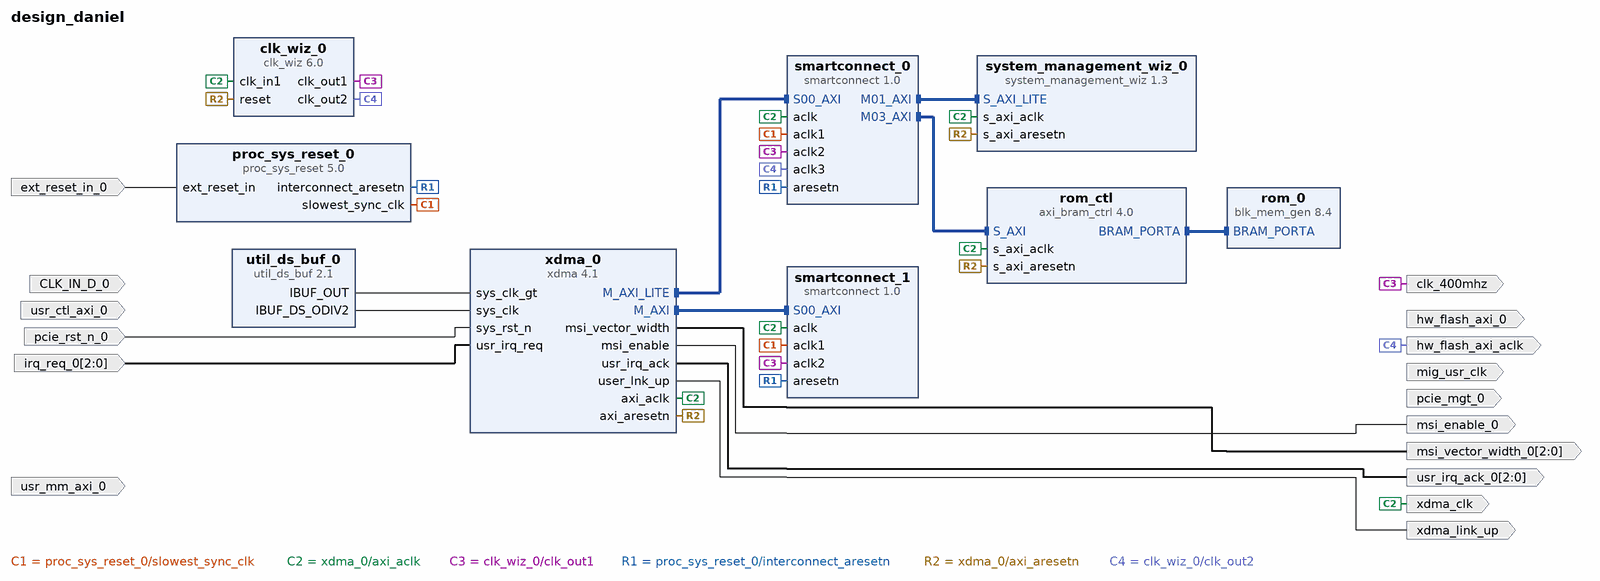
[diagram p0: block diagram of the top level]
# Vivado block design design_daniel, xcvu9p-flgb2104-2-i, Vivado 2018.2_AR71275_op
create_bd_design design_daniel

create_bd_port -dir O xdma_clk
create_bd_port -dir O mig_usr_clk
create_bd_port -dir O clk_400mhz
create_bd_port -dir I usr_mm_axi_0
create_bd_port -dir I usr_ctl_axi_0
create_bd_port -dir O hw_flash_axi_0
create_bd_port -dir I ext_reset_in_0
create_bd_port -dir O hw_flash_axi_aclk
create_bd_port -dir I -type clk CLK_IN_D_0
create_bd_port -dir I pcie_rst_n_0
create_bd_port -dir I -from 2 -to 0 irq_req_0
create_bd_port -dir O -from 2 -to 0 msi_vector_width_0
create_bd_port -dir O msi_enable_0
create_bd_port -dir O -from 2 -to 0 usr_irq_ack_0
create_bd_port -dir O xdma_link_up
create_bd_port -dir O pcie_mgt_0

create_bd_cell -type ip -vlnv xilinx.com:ip:smartconnect:1.0 smartconnect_0
set_property -dict {CONFIG.NUM_MI 5 CONFIG.NUM_CLKS 4} [get_bd_cells smartconnect_0]
create_bd_cell -type ip -vlnv xilinx.com:ip:smartconnect:1.0 smartconnect_1
set_property -dict {CONFIG.NUM_CLKS 3} [get_bd_cells smartconnect_1]
create_bd_cell -type ip -vlnv xilinx.com:ip:proc_sys_reset:5.0 proc_sys_reset_0
create_bd_cell -type ip -vlnv xilinx.com:ip:axi_bram_ctrl:4.0 rom_ctl
set_property -dict {CONFIG.SINGLE_PORT_BRAM 1} [get_bd_cells rom_ctl]
create_bd_cell -type ip -vlnv xilinx.com:ip:system_management_wiz:1.3 system_management_wiz_0
create_bd_cell -type ip -vlnv xilinx.com:ip:xdma:4.1 xdma_0
set_property -dict [list \
  CONFIG.functional_mode DMA \
  CONFIG.mode_selection Advanced \
  CONFIG.pcie_blk_locn X0Y1 \
  CONFIG.pl_link_cap_max_link_width X1 \
  CONFIG.axi_data_width 64_bit \
  CONFIG.en_axi_slave_if false \
  CONFIG.pipe_sim false \
  CONFIG.en_ext_ch_gt_drp false \
  CONFIG.en_pcie_drp false \
  CONFIG.sys_reset_polarity ACTIVE_LOW \
  CONFIG.pf0_device_id 9011 \
  CONFIG.pf0_Use_Class_Code_Lookup_Assistant false \
  CONFIG.axilite_master_en true \
  CONFIG.axist_bypass_en false \
  CONFIG.pf0_msi_enabled true \
  CONFIG.en_transceiver_status_ports false \
  CONFIG.xdma_axilite_slave false \
  CONFIG.en_gt_selection false \
  CONFIG.xdma_axi_intf_mm AXI_Memory_Mapped \
  CONFIG.xdma_pcie_64bit_en false \
  CONFIG.xdma_sts_ports false \
  CONFIG.pf0_msix_enabled false \
  CONFIG.axil_master_64bit_en false \
  CONFIG.parity_settings None \
  CONFIG.dma_reset_source_sel User_Reset \
  CONFIG.PF0_DEVICE_ID_mqdma 9011 \
  CONFIG.PF2_DEVICE_ID_mqdma 9011 \
  CONFIG.PF3_DEVICE_ID_mqdma 9011 \
  CONFIG.enable_auto_rxeq False \
] [get_bd_cells xdma_0]
create_bd_cell -type ip -vlnv xilinx.com:ip:util_ds_buf:2.1 util_ds_buf_0
set_property -dict {CONFIG.C_BUF_TYPE IBUFDSGTE} [get_bd_cells util_ds_buf_0]
create_bd_cell -type ip -vlnv xilinx.com:ip:clk_wiz:6.0 clk_wiz_0
set_property -dict [list \
  CONFIG.USE_INCLK_SWITCHOVER false \
  CONFIG.SECONDARY_SOURCE Single_ended_clock_capable_pin \
  CONFIG.CLKIN2_JITTER_PS 149.99 \
  CONFIG.CLKOUT2_USED true \
  CONFIG.NUM_OUT_CLKS 2 \
  CONFIG.MMCM_DIVCLK_DIVIDE 1 \
  CONFIG.MMCM_CLKIN2_PERIOD 10.000 \
  CONFIG.MMCM_CLKOUT1_DIVIDE 12 \
  CONFIG.CLKOUT2_JITTER 115.831 \
  CONFIG.CLKOUT2_PHASE_ERROR 87.180 \
] [get_bd_cells clk_wiz_0]
create_bd_cell -type ip -vlnv xilinx.com:ip:blk_mem_gen:8.4 rom_0

# ---- connections ----

connect_bd_intf_net [get_bd_intf_pins smartconnect_0/M01_AXI] [get_bd_intf_pins system_management_wiz_0/S_AXI_LITE]
connect_bd_intf_net [get_bd_intf_pins smartconnect_0/M03_AXI] [get_bd_intf_pins rom_ctl/S_AXI]
connect_bd_intf_net -intf_net axi_bram_ctrl_0_BRAM_PORTA [get_bd_intf_pins rom_ctl/BRAM_PORTA] [get_bd_intf_pins rom_0/BRAM_PORTA]
connect_bd_intf_net [get_bd_intf_pins xdma_0/M_AXI] [get_bd_intf_pins smartconnect_1/S00_AXI]
connect_bd_intf_net [get_bd_intf_pins smartconnect_0/S00_AXI] [get_bd_intf_pins xdma_0/M_AXI_LITE]
connect_bd_net [get_bd_pins proc_sys_reset_0/slowest_sync_clk] [get_bd_pins smartconnect_1/aclk1] [get_bd_pins smartconnect_0/aclk1]
connect_bd_net [get_bd_pins xdma_0/axi_aclk] \
  [get_bd_ports xdma_clk] [get_bd_pins clk_wiz_0/clk_in1] [get_bd_pins system_management_wiz_0/s_axi_aclk] \
  [get_bd_pins rom_ctl/s_axi_aclk] [get_bd_pins smartconnect_1/aclk] [get_bd_pins smartconnect_0/aclk]
connect_bd_net [get_bd_pins clk_wiz_0/clk_out1] [get_bd_pins smartconnect_1/aclk2] [get_bd_pins smartconnect_0/aclk2] [get_bd_ports clk_400mhz]
connect_bd_net [get_bd_pins proc_sys_reset_0/interconnect_aresetn] [get_bd_pins smartconnect_1/aresetn] [get_bd_pins smartconnect_0/aresetn]
connect_bd_net -net ext_reset_in_0_1 [get_bd_ports ext_reset_in_0] [get_bd_pins proc_sys_reset_0/ext_reset_in]
connect_bd_net [get_bd_pins xdma_0/axi_aresetn] \
  [get_bd_pins clk_wiz_0/reset] [get_bd_pins system_management_wiz_0/s_axi_aresetn] [get_bd_pins rom_ctl/s_axi_aresetn]
connect_bd_net [get_bd_pins clk_wiz_0/clk_out2] [get_bd_pins smartconnect_0/aclk3] [get_bd_ports hw_flash_axi_aclk]
connect_bd_net [get_bd_pins util_ds_buf_0/IBUF_OUT] [get_bd_pins xdma_0/sys_clk_gt]
connect_bd_net [get_bd_pins util_ds_buf_0/IBUF_DS_ODIV2] [get_bd_pins xdma_0/sys_clk]
connect_bd_net -net pcie_rst_n_0_1 [get_bd_ports pcie_rst_n_0] [get_bd_pins xdma_0/sys_rst_n]
connect_bd_net -net irq_req_0_1 [get_bd_ports irq_req_0] [get_bd_pins xdma_0/usr_irq_req]
connect_bd_net [get_bd_pins xdma_0/msi_vector_width] [get_bd_ports msi_vector_width_0]
connect_bd_net [get_bd_pins xdma_0/msi_enable] [get_bd_ports msi_enable_0]
connect_bd_net [get_bd_pins xdma_0/usr_irq_ack] [get_bd_ports usr_irq_ack_0]
connect_bd_net [get_bd_pins xdma_0/user_lnk_up] [get_bd_ports xdma_link_up]

validate_bd_design
save_bd_design
